# Altium schematic sheet MCU.SchDoc
size Letter; SheetNumber: 2; SheetTotal: 4
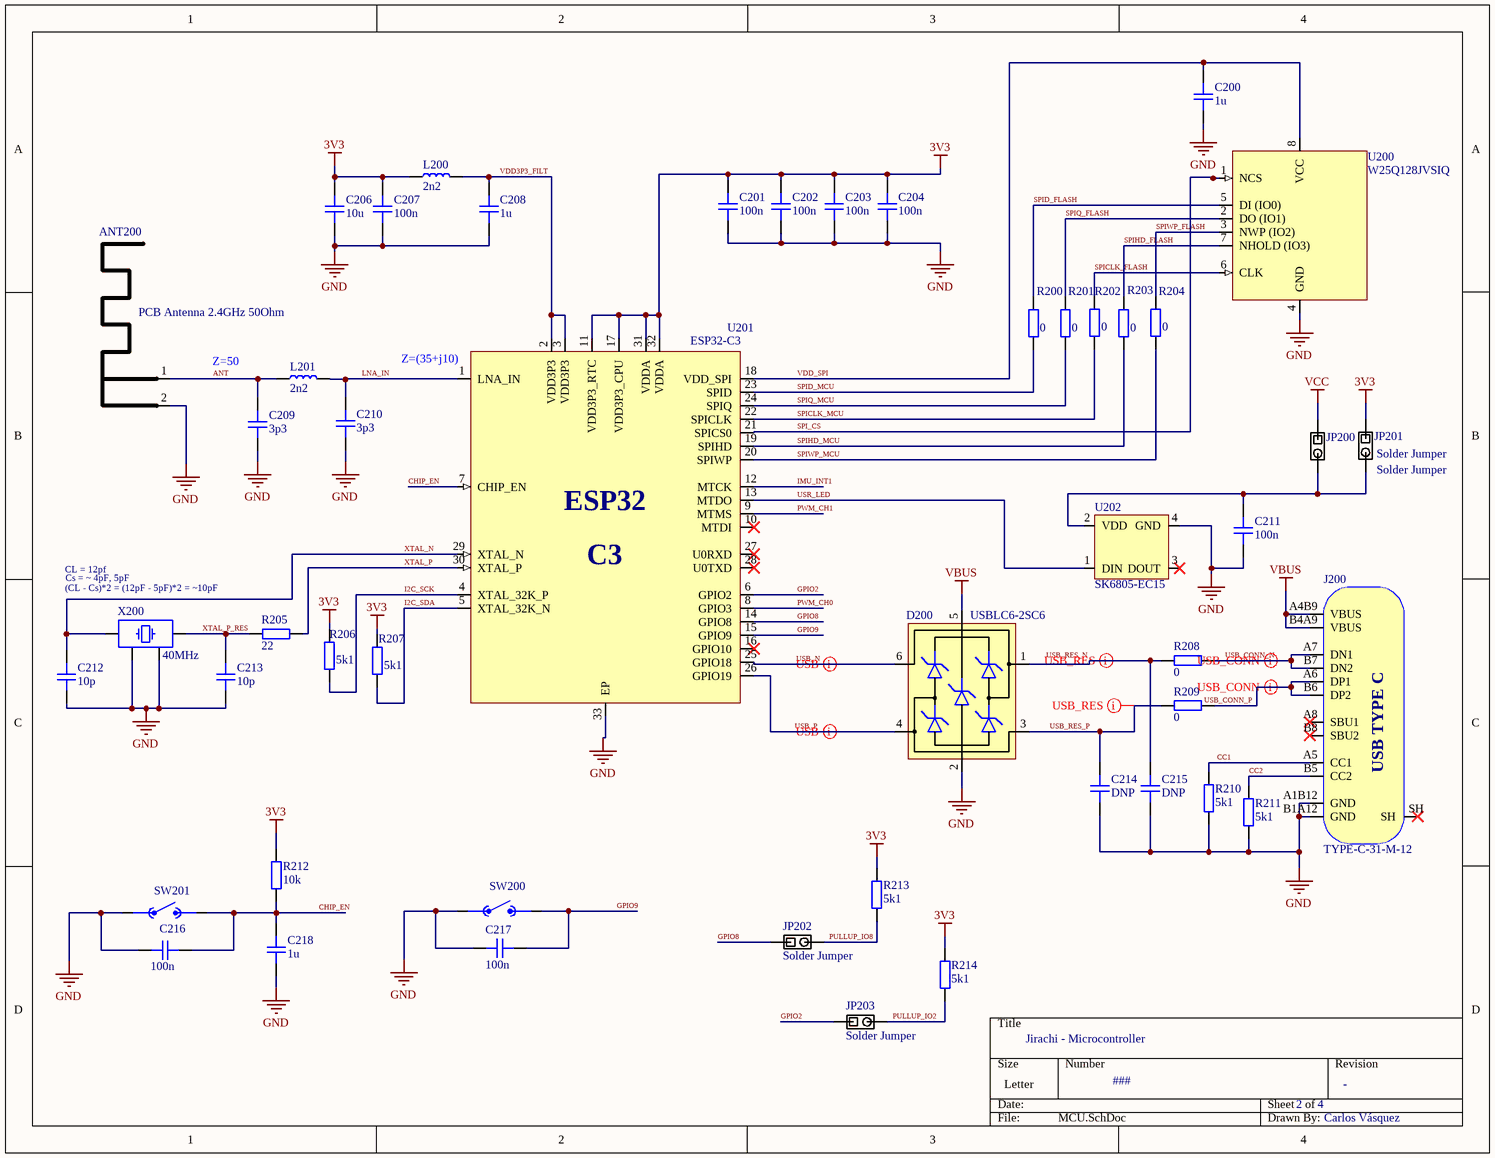
[diagram p0: MCU.SchDoc]

## Parts
ANT200  PCB Antenna 2.4GHz 50Ohm  [ANT_IFA_USB_2_4GHZ_50R]  (no BOM)
C200  1u  [CAP_0402]
C201  100n  [CAP_0402]
C202  100n  [CAP_0402]
C203  100n  [CAP_0402]
C204  100n  [CAP_0402]
C206  10u  [CAP_0603]
C207  100n  [CAP_0402]
C208  1u  [CAP_0402]
C209  3p3  [CAP_0402]
C210  3p3  [CAP_0402]
C211  100n  [CAP_0402]
C212  10p  [CAP_0402]
C213  10p  [CAP_0402]
C214  DNP  [CAP_0603]
C215  DNP  [CAP_0603]
C216  100n  [CAP_0402]
C217  100n  [CAP_0402]
C218  1u  [CAP_0402]
D200  USBLC6-2SC6  [SOT-23-6]
J200  TYPE-C-31-M-12  [TYPE-C-31-M-12]
JP200  Solder Jumper  [SolderJumper_Single]
JP201  Solder Jumper  [SolderJumper_Single]
JP202  Solder Jumper  [SolderJumper_Single]
JP203  Solder Jumper  [SolderJumper_Single]
L200  2n2  [IND_0402]
L201  2n2  [IND_0402]
R200  0  [RES_0402]
R201  0  [RES_0402]
R202  0  [RES_0402]
R203  0  [RES_0402]
R204  0  [RES_0402]
R205  22  [RES_0402]
R206  5k1  [RES_0402]
R207  5k1  [RES_0402]
R208  0  [RES_0402]
R209  0  [RES_0402]
R210  5k1  [RES_0402]
R211  5k1  [RES_0402]
R212  10k  [RES_0402]
R213  5k1  [RES_0402]
R214  5k1  [RES_0402]
SW200  SW SPST SMD Terreneitor  [SW SPST SMD Terreneitor]  (value not drawn)
SW201  SW SPST SMD Terreneitor  [SW SPST SMD Terreneitor]  (value not drawn)
U200  W25Q128JVSIQ  [SOIC8_208 mil]
U201  ESP32-C3  [QFN32-5x5]
U202  SK6805-EC15  [SK6805-EC15]
X200  40MHz  [XTAL_3225]

## Nets
3V3: C201.1 C202.1 C203.1 C204.1 C206.1 C207.1 JP201.1 L200.1 R206.2 R207.2 R212.2 R213.2 R214.2 U201.11(VDD3P3_RTC) U201.17(VDD3P3_CPU) U201.31(VDDA) U201.32(VDDA)
GND: ANT200.2(GND) C200.1 C201.2 C202.2 C203.2 C204.2 C206.2 C207.2 C208.1 C209.1 C210.1 C211.1 C212.2 C213.2 C214.1 C215.1 C216.2 C217.2 C218.1 D200.2(GND) J200.A1B12(GND) J200.B1A12(GND) R210.1 R211.1 SW200.1 SW201.1 U200.4(GND) U201.33(EP) U202.4(GND) X200.2 X200.4
VBUS: D200.5(VBUS) J200.A4B9(VBUS) J200.B4A9(VBUS)
VCC: JP200.1
ANT: ANT200.1(RF) C209.2 L201.1
CC1: J200.A5(CC1) R210.2
CC2: J200.B5(CC2) R211.2
CHIP_EN: C216.1 C218.2 R212.1 SW201.2 U201.7(CHIP_EN)
GPIO2: JP203.1 U201.6(GPIO2)
GPIO8: JP202.1 U201.14(GPIO8)
GPIO9: C217.1 SW200.2 U201.15(GPIO9)
I2C_SCK: R206.1 U201.4(XTAL_32K_P)
I2C_SDA: R207.1 U201.5(XTAL_32K_N)
IMU_INT1: U201.12(MTCK)
LNA_IN: C210.2 L201.2 U201.1(LNA_IN)
PULLUP_IO2: JP203.2 R214.1
PULLUP_IO8: JP202.2 R213.1
PWM_CH0: U201.8(GPIO3)
PWM_CH1: U201.9(MTMS)
SPI_CS: U200.1(NCS) U201.21(SPICS0)
SPICLK_FLASH: R202.2 U200.6(CLK)
SPICLK_MCU: R202.1 U201.22(SPICLK)
SPID_FLASH: R200.2 U200.5(DI_(IO0))
SPID_MCU: R200.1 U201.23(SPID)
SPIHD_FLASH: R203.2 U200.7(NHOLD_(IO3))
SPIHD_MCU: R203.1 U201.19(SPIHD)
SPIQ_FLASH: R201.2 U200.2(DO_(IO1))
SPIQ_MCU: R201.1 U201.24(SPIQ)
SPIWP_FLASH: R204.2 U200.3(NWP_(IO2))
SPIWP_MCU: R204.1 U201.20(SPIWP)
USB_CONN_N: J200.A7(DN1) J200.B7(DN2) R208.2
USB_CONN_P: J200.A6(DP1) J200.B6(DP2) R209.2
USB_N: D200.6(IO1) U201.25(GPIO18)
USB_P: D200.4(IO2) U201.26(GPIO19)
USB_RES_N: C215.2 D200.1(IO1) R208.1
USB_RES_P: C214.2 D200.3(IO2) R209.1
USR_LED: U201.13(MTDO) U202.1(DIN)
VDD3P3_FILT: C208.2 L200.2 U201.2(VDD3P3) U201.3(VDD3P3)
VDD_SPI: C200.2 U200.8(VCC) U201.18(VDD_SPI)
XTAL_N: C212.1 U201.29(XTAL_N) X200.1
XTAL_P: R205.2 U201.30(XTAL_P)
XTAL_P_RES: C213.1 R205.1 X200.3
NetC211_2: C211.2 JP200.2 JP201.2 U202.2(VDD)

Not connected (* = marked no-connect by the designer): J200 A8(SBU1)* B8(SBU2)* SH*; U201 10(MTDI)* 16(GPIO10)* 27(U0RXD)* 28(U0TXD)*; U202 3(DOUT)*

## Layout directives
differential pair: USB_CONN_N, USB_CONN_P, USB_N, USB_P, USB_RES_N, USB_RES_P

## Notes on the sheet
- Z=50
- (near U201) Z=(35+j10)
- CL = 12pf
- (CL - Cs)*2 = (12pF - 5pF)*2 = ~10pF
- (near X200) Cs = ~ 4pF, 5pF
- Jirachi - Microcontroller
- ###
- 2
- -
- Carlos Vásquez
- (in symbol ESP32-C3) ESP32; C3
- (in symbol TYPE-C-31-M-12) USB TYPE C

## Library data of the parts
ANT200 = ANT_IFA_USB_2_4GHZ_50R: Inverted F 2.4GHz ISM PCB Antenna 50 Ohm; ComponentLink1Description: Datasheet; ComponentLink1URL: https://www.ti.com/lit/an/swra117d/swra117d.pdf
C200-C204 C207-C213 C216-C218 = CAP_0402: Capacitor SMD 0402; Manufacturer: *; Manufacturer Part Number: *; Distributor Link: *; LCSC: *; Rating: *; Dielectric: *
C206 C214 C215 = CAP_0603: Capacitor SMD 0603; Manufacturer: *; Manufacturer Part Number: *; Distributor Link: *; LCSC: *; Rating: *; Dielectric: *
D200 = USBLC6-2SC6: Low-Capacitance ESD Protection USB; Manufacturer: STMicroelectronics; Manufacturer Part Number: USBLC6-2SC6; Distributor Link: https://www.mouser.de/ProductDetail/STMicroelectronics/USBLC6-2SC6?qs=po45yt2pPpu%2FhNIlwQdTlg%3D%3D
J200 = TYPE-C-31-M-12: USB Type C Connector Horizontal SMT; Manufacturer: Koren Hroparts; Manufacturer Part Number: TYPE-C-31-M-12
JP200-JP203 = SolderJumper_Single: Solder Jumper Single 0.5mm Pitch
L200 L201 = IND_0402: Inductor SMD 0402
R200-R214 = RES_0402: Resistor SMD 0402; Manufacturer: *; Manufacturer Part Number: *; Distributor Link: *; LCSC: *
SW200 SW201 = SW SPST SMD Terreneitor: SPST SW TS-1187A-B-A-B
U200 = W25Q128JVSIQ: 128M-BIT / SERIAL FLASH MEMORY WITH / DUAL/QUAD SPI & QPI & DTR SOIC-8 208 MIL; Manufacturer: Winbond; Manufacturer Part Number: W25Q128JVSIM
U201 = ESP32-C3: Ultra­Low­Power SoC with RISC­V Single­Core CPU Supporting IEEE 802.11b/g/n (2.4 GHz Wi­Fi) and Bluetooth® 5 (LE); Manufacturer: Espressif; Manufacturer Part Number: ESP32-C3; LCSC: C2838500
X200 = TSX-3225_24.0000MF15X-AC: Crystal SMD 40MHz 10PPM 12pF 3225; Manufacturer: Epson; Manufacturer Part Number: TSX-3225 24.0000MF15X-AC